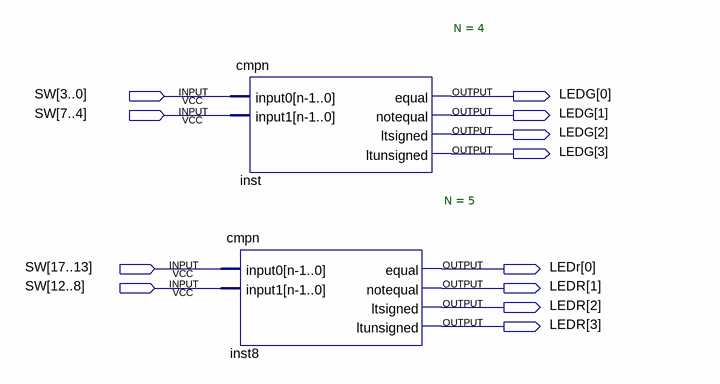
[diagram p0: schematic sheet]
// Quartus schematic CmpN_Demo.bdf as structural Verilog: 2 symbols, 12 pins
module CmpN_Demo (
  input  [17:0] SW,
  output [3:0] LEDG,
  output [3:0] LEDr
);

  cmpn #(.N(4)) inst (
    .input0(SW[3:0]), .input1(SW[7:4]), .equal(LEDG[0]), .notequal(LEDG[1]), .ltsigned(LEDG[2]),
    .ltunsigned(LEDG[3]));
  cmpn #(.N(5)) inst8 (
    .input0(SW[17:13]), .input1(SW[12:8]), .equal(LEDr[0]), .notequal(LEDr[1]), .ltsigned(LEDr[2]),
    .ltunsigned(LEDr[3]));
endmodule
